# EAGLE design H_BRIDGE_rev2 (EAGLE 5.06)
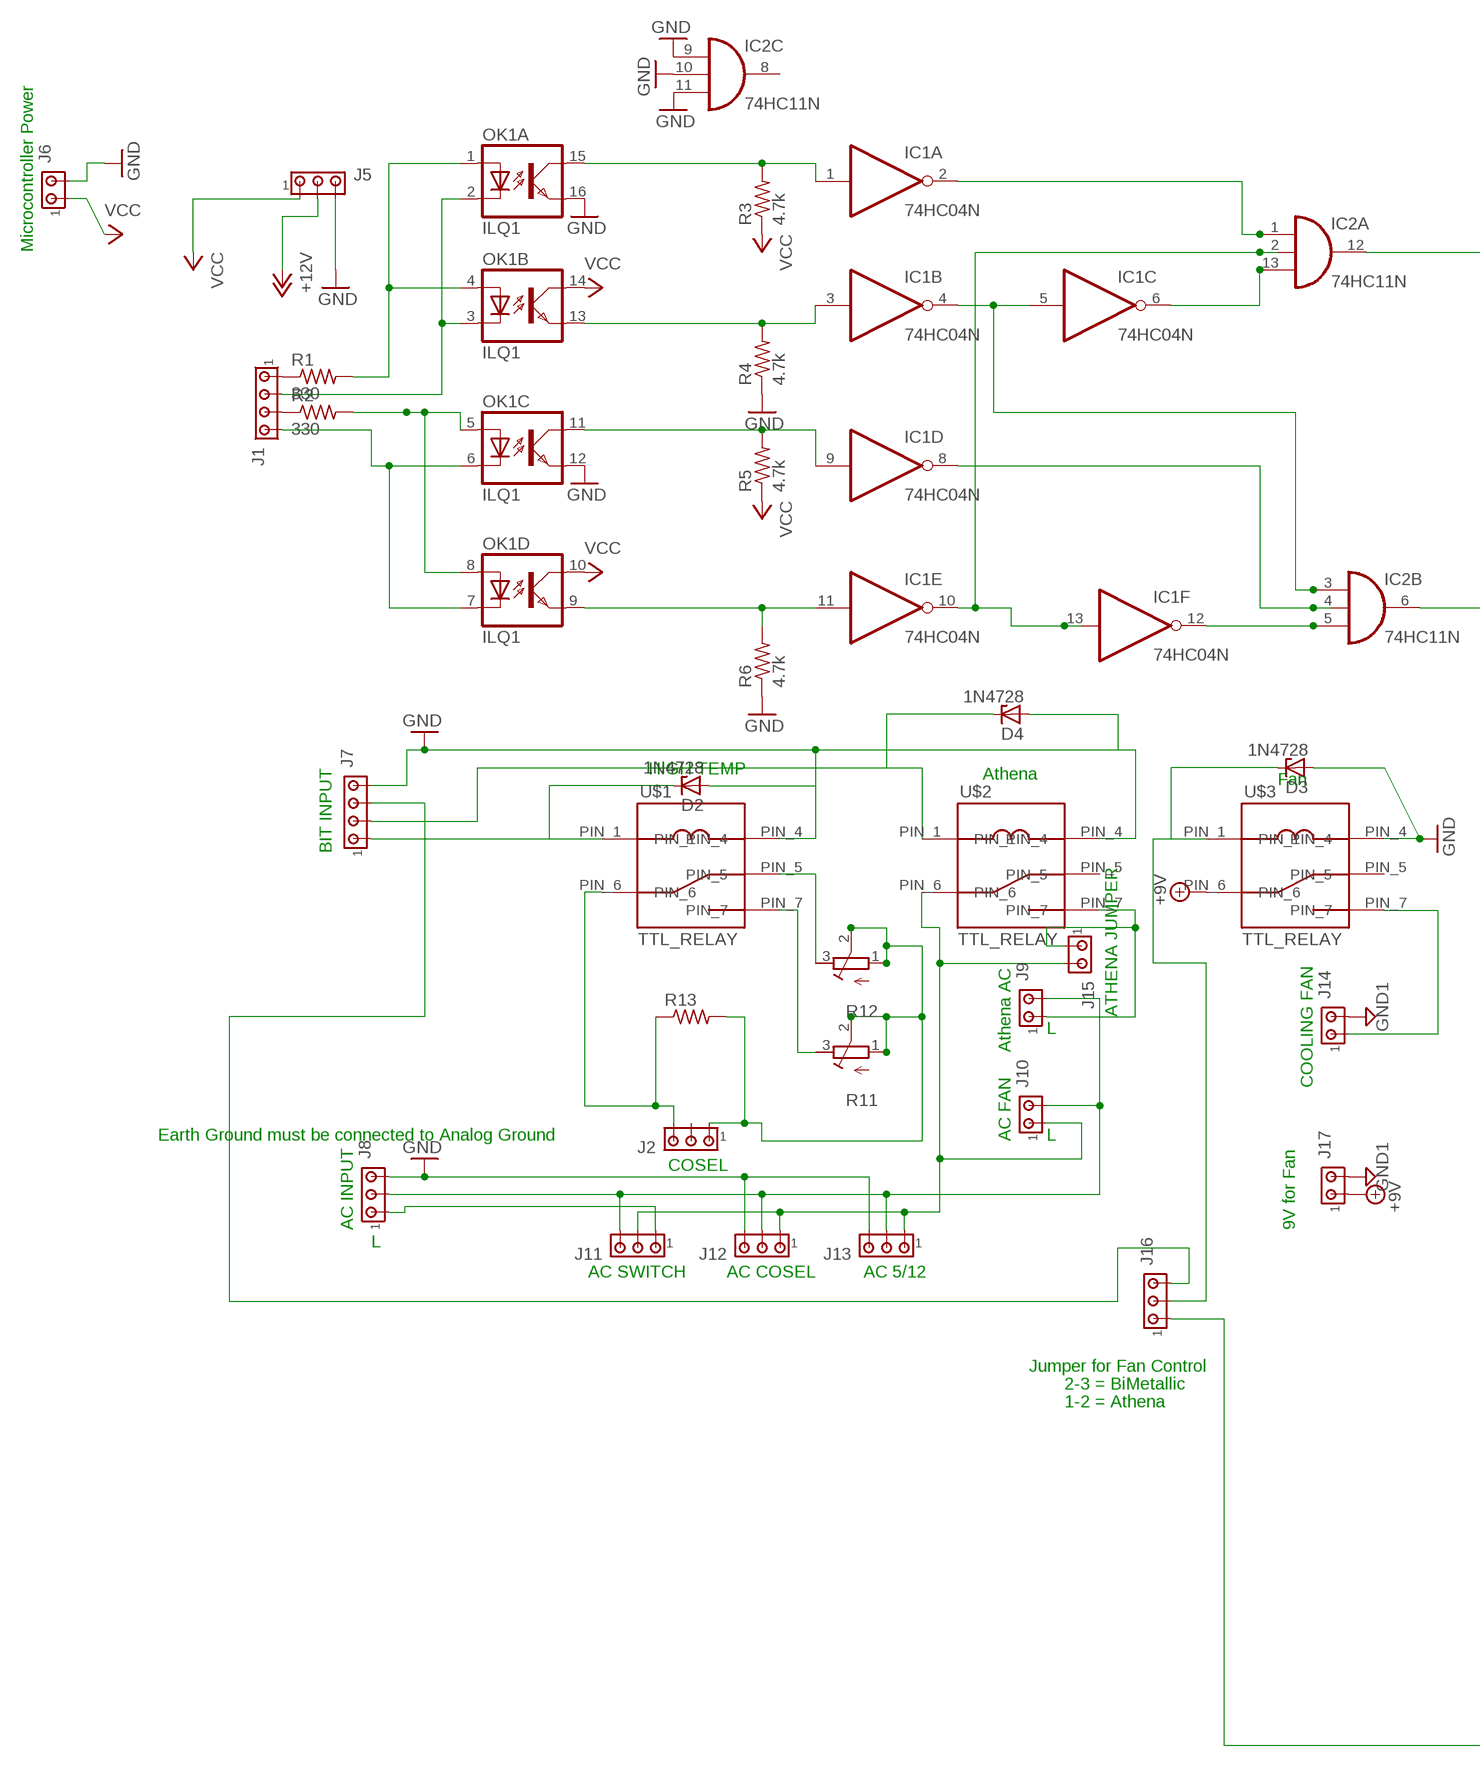
[diagram p0: schematic, sheet 1, part 1 of 2]
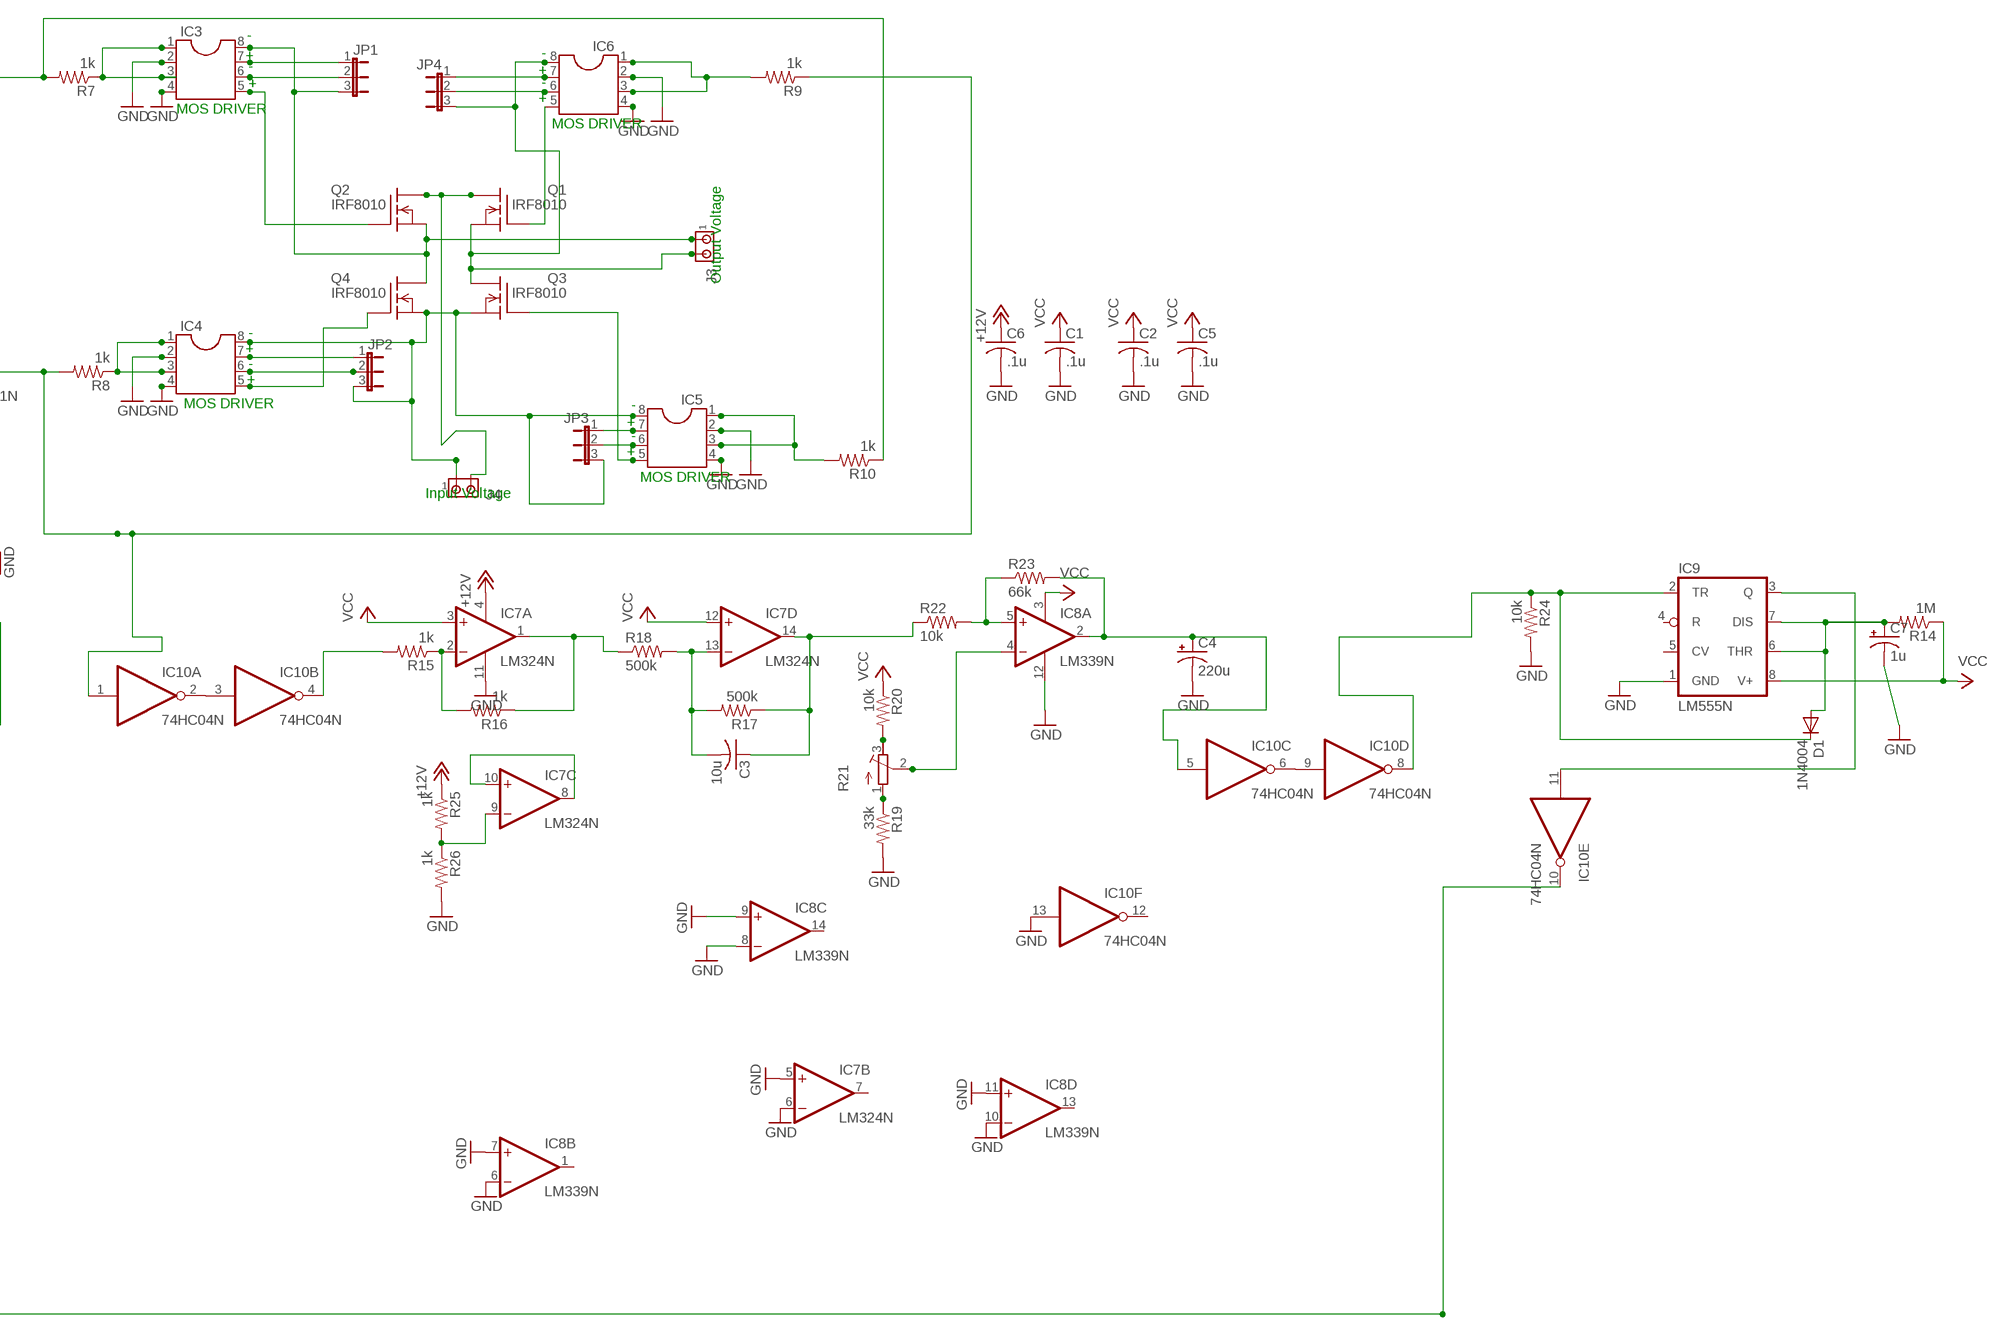
[diagram p1: schematic, sheet 1, part 2 of 2]

## Parts
C1  .1u  C-US025-030X050  [C025-030X050]
C2  .1u  C-US025-030X050  [C025-030X050]
C3  10u  C-US050-025X075  [C050-025X075]
C4  220u  CPOL-USE5-13  [E5-13]
C5  .1u  C-US025-030X050  [C025-030X050]
C6  .1u  C-US025-030X050  [C025-030X050]
C7  1u  CPOL-USE2.5-6  [E2,5-6]
D1  1N4004  [DO41-10]
D2  1N4728  [DO41Z10]
D3  1N4728  [DO41Z10]
D4  1N4728  [DO41Z10]
IC1  74HC04N  [DIL14]
IC2  74HC11N  [DIL14]
IC3  DIL8  [DIL08]
IC4  DIL8  [DIL08]
IC5  DIL8  [DIL08]
IC6  DIL8  [DIL08]
IC7  LM324N  [DIL14]
IC8  LM339N  [DIL14]
IC9  LM555N  [DIL08]
IC10  74HC04N  [DIL14]
J1  MTA04-100  [10X04MTA]
J2  MTA03-100  [10X03MTA]
J3  MTA02-156  [1X2MTA]
J4  MTA02-156  [1X2MTA]
J5  MTA03-156  [1X3MTA]
J6  MTA02-100  [10X02MTA]
J7  MTA04-100  [10X04MTA]
J8  MTA03-156  [1X3MTA]
J9  MTA02-100  [10X02MTA]
J10  MTA02-156  [1X2MTA]
J11  MTA03-156  [1X3MTA]
J12  MTA03-156  [1X3MTA]
J13  MTA03-156  [1X3MTA]
J14  MTA02-156  [1X2MTA]
J15  MTA02-100  [10X02MTA]
J16  MTA03-100  [10X03MTA]
J17  MTA02-156  [1X2MTA]
JP1  JP2E  [JP2]
JP2  JP2E  [JP2]
JP3  JP2E  [JP2]
JP4  JP2E  [JP2]
OK1  ILQ1  [DIL16]
Q1  IRF8010  IRF840  [TO220]
Q2  IRF8010  IRF840  [TO220]
Q3  IRF8010  IRF840  [TO220]
Q4  IRF8010  IRF840  [TO220]
R1  330  R-US_0204/7  [0204/7]
R2  330  R-US_0204/7  [0204/7]
R3  4.7k  R-US_0204/7  [0204/7]
R4  4.7k  R-US_0204/7  [0204/7]
R5  4.7k  R-US_0204/7  [0204/7]
R6  4.7k  R-US_0204/7  [0204/7]
R7  1k  R-US_0204/7  [0204/7]
R8  1k  R-US_0204/7  [0204/7]
R9  1k  R-US_0204/7  [0204/7]
R10  1k  R-US_0204/7  [0204/7]
R11  R-TRIMM3296W  [RTRIM3296W]
R12  R-TRIMM3296W  [RTRIM3296W]
R13  R-US_0204/7  [0204/7]
R14  1M  R-US_0204/7  [0204/7]
R15  1k  R-US_0204/7  [0204/7]
R16  1k  R-US_0204/7  [0204/7]
R17  500k  R-US_0204/7  [0204/7]
R18  500k  R-US_0204/7  [0204/7]
R19  33k  R-US_0204/7  [0204/7]
R20  10k  R-US_0204/7  [0204/7]
R21  R-TRIMM3296W  [RTRIM3296W]
R22  10k  R-US_0204/7  [0204/7]
R23  66k  R-US_0204/7  [0204/7]
R24  10k  R-US_0204/7  [0204/7]
R25  1k  R-US_0204/7  [0204/7]
R26  1k  R-US_0204/7  [0204/7]
U$1  TTL_RELAY  [R1OS-E1Y1-J1.0K]
U$2  TTL_RELAY  [R1OS-E1Y1-J1.0K]
U$3  TTL_RELAY  [R1OS-E1Y1-J1.0K]

## Nets
+9V: J17.1 U$3.PIN_6
+12V: C6.1 IC7.4(P:V+) J5.2 R25.1
GND: C1.2 C2.2 C4.- C5.2 C6.2 C7.- D2.A D3.A D4.A IC2.9(C:I0) IC2.10(C:I1) IC2.11(C:I2) IC3.2 IC3.4 IC4.2 IC4.4 IC5.2 IC5.4 IC6.2 IC6.4 IC7.5(B:+IN) IC7.6(B:-IN) IC7.11(P:V-) IC8.6(B:-IN) IC8.7(B:+IN) IC8.8(C:-IN) IC8.9(C:+IN) IC8.10(D:-IN) IC8.11(D:+IN) IC8.12(P:GND) IC9.1(GND) IC10.13(F:I) J5.3 J6.2 J7.4 J8.3 J12.3 J13.3 OK1.12(C:EMIT) OK1.16(A:EMIT) R4.1 R6.1 R19.2 R24.2 R26.2 U$1.PIN_4 U$2.PIN_4 U$3.PIN_4
GND1: J14.2 J17.2
N$1: J1.1 R1.1
N$2: J1.3 R2.1
N$3: OK1.1(A:A) OK1.4(B:A) R1.2
N$4: J1.2 OK1.2(A:C) OK1.3(B:C)
N$5: OK1.5(C:A) OK1.8(D:A) R2.2
N$6: J1.4 OK1.6(C:C) OK1.7(D:C)
N$7: IC1.1(A:I) OK1.15(A:COL) R3.2
N$8: IC1.3(B:I) OK1.13(B:EMIT) R4.2
N$9: IC1.9(D:I) OK1.11(C:COL) R5.2
N$10: IC1.11(E:I) OK1.9(D:EMIT) R6.2
N$11: IC1.4(B:O) IC1.5(C:I) IC2.3(B:I0)
N$12: IC1.10(E:O) IC1.13(F:I) IC2.2(A:I1)
N$13: IC1.2(A:O) IC2.1(A:I0)
N$14: IC1.6(C:O) IC2.13(A:I2)
N$15: IC1.8(D:O) IC2.4(B:I1)
N$16: IC1.12(F:O) IC2.5(B:I2)
N$17: IC2.12(A:O) R7.2 R10.1
N$18: IC2.6(B:O) IC10.1(A:I) R8.2 R9.1
N$19: IC3.1 IC3.3 R7.1
N$20: IC5.1 IC5.3 R10.2
N$21: IC6.1 IC6.3 R9.2
N$22: IC4.1 IC4.3 R8.1
N$23: IC4.5 Q4.1(G)
N$24: IC5.5 Q3.1(G)
N$25: D3.C J16.2 U$3.PIN_1
N$26: IC3.5 Q2.1(G)
N$27: IC4.6 JP2.2
N$28: IC4.7 JP2.1
N$29: IC3.6 JP1.2
N$30: IC3.7 JP1.1
N$31: IC6.6 JP4.2
N$32: IC6.7 JP4.1
N$33: IC5.6 JP3.2
N$34: IC5.7 JP3.1
N$35: IC4.8 IC5.8 J4.1 JP2.3 JP3.3 Q3.3(S) Q4.3(S)
N$36: IC6.8 J3.2 JP4.3 Q1.3(S) Q3.2(D)
N$37: J7.3 J16.3
N$39: J4.2 Q1.2(D) Q2.2(D)
N$40: IC3.8 J3.1 JP1.3 Q2.3(S) Q4.2(D)
N$42: IC6.5 Q1.1(G)
N$43: D2.C J7.1 U$1.PIN_1
N$49: D4.C J7.2 U$2.PIN_1
N$50: R12.3(A) U$1.PIN_5
N$51: J2.1 R11.1(E) R11.2(S) R12.1(E) R12.2(S) R13.2
N$52: J8.1 J11.1
N$53: R11.3(A) U$1.PIN_7
N$54: J2.3 R13.1 U$1.PIN_6
N$55: J10.1 J11.2 J12.1 J13.1 J15.2 U$2.PIN_6
N$56: J9.1 J15.1 U$2.PIN_7
N$57: J8.2 J9.2 J10.2 J11.3 J12.2 J13.2
N$59: IC10.4(B:O) R15.2
N$60: IC7.2(A:-IN) R15.1 R16.2
N$61: IC7.8(C:OUT) IC7.10(C:+IN)
N$62: IC7.1(A:OUT) R16.1 R18.1
N$63: C3.2 IC7.13(D:-IN) R17.2 R18.2
N$64: C3.1 IC7.14(D:OUT) R17.1 R22.1
N$65: IC7.9(C:-IN) R25.2 R26.1
N$66: R20.2 R21.3(A)
N$67: R19.1 R21.1(E)
N$68: IC8.4(A:-IN) R21.2(S)
N$69: IC10.2(A:O) IC10.3(B:I)
N$70: IC8.5(A:+IN) R22.2 R23.1
N$71: C4.+ IC8.2(A:OUT) IC10.5(C:I) R23.2
N$72: IC10.10(E:O) J16.1
N$73: J14.1 U$3.PIN_7
N$74: IC10.6(C:O) IC10.9(D:I)
N$76: IC9.3(Q) IC10.11(E:I)
N$77: D1.C IC9.2(TR) IC10.8(D:O) R24.1
N$78: C7.+ D1.A IC9.6(THR) IC9.7(DIS) R14.2
VCC: C1.1 C2.1 C5.1 IC7.3(A:+IN) IC7.12(D:+IN) IC8.3(P:V+) IC9.8(V+) J5.1 J6.1 OK1.10(D:COL) OK1.14(B:COL) R3.1 R5.1 R14.1 R20.1
Unconnected: IC2.8(C:O) IC7.7(B:OUT) IC8.1(B:OUT) IC8.13(D:OUT) IC8.14(C:OUT) IC9.4(R) IC9.5(CV) IC10.12(F:O) J2.2 U$2.PIN_5 U$3.PIN_5

## Notes on the sheet
- -
- + | -
- -
- Microcontroller Power | +
- + | -
- +
- MOS DRIVER
- MOS DRIVER
- Output Voltage
- -
- +
- -
- +
- MOS DRIVER | -
- +
- -
- +
- MOS DRIVER
- Input Voltage
- HIGH TEMP
- Athena
- Fan
- BIT INPUT
- ATHENA JUMPER
- L
- Athena AC
- COOLING FAN
- Earth Ground must be connected to Analog Ground | AC FAN | L
- COSEL
- AC INPUT | 9V for Fan
- L
- AC SWITCH | AC COSEL | AC 5/12
- Jumper for Fan Control
- 2-3 = BiMetallic
- 1-2 = Athena

## Power pins joined to a net without a drawn wire
GND: IC1.7(P:GND) IC2.7(P:GND) IC10.7(P:GND)
VCC: IC1.14(P:VCC) IC2.14(P:VCC) IC10.14(P:VCC)

## Library data of the parts
C1-C3 C5 C6 = rcl:C-US: CAPACITOR, American symbol
C4 = rcl:CPOL-US: POLARIZED CAPACITOR, American symbol
C7 = resistor:CPOL-US: POLARIZED CAPACITOR, American symbol
D1 = diode:1N4004: DIODE general purpose rectifier, 1 A
D2-D4 = diode:1N4728: Z DIODE 3.3 V, 1W, 5 percent
IC1 IC10 = 74xx-eu:74*04: Hex INVERTER
IC2 = 74xx-eu:74*11: Triple 3-input AND gate
IC3-IC6 = ic-package:DIL8: Dual In Line / Socket
IC7 = linear:LM324: OP AMP
IC8 = linear:LM339: Low Power Low Offset Voltage Quad Comparators with open collector; LM139/LM239/LM339/LM2901/LM3302
IC9 = linear:*555: TIMER
J1 J7 = con-amp:MTA04-100: AMP connector
J2 J16 = con-amp:MTA03-100: AMP connector
J3 J4 J10 J14 J17 = con-amp:MTA02-156: AMP connector
J5 J8 J11-J13 = con-amp:MTA03-156: AMP connector
J6 J9 J15 = con-amp:MTA02-100: AMP connector
JP1-JP4 = jumper:JP2E: JUMPER
OK1 = optocoupler:ILQ1: SIEMENS OPTO COUPLER
Q1-Q4 = transistor-fet:IRF840: N-Channel Enhancement MOSFET (HEXFET); 500V; 8A; 0,85Ohm
R1-R10 R13-R20 R22-R26 = rcl:R-US_: RESISTOR, American symbol
R11 R12 R21 = rcl:R-TRIMM: Trimm resistor
U$1-U$3 = Anthony-Relay:TTL_RELAY

## Board
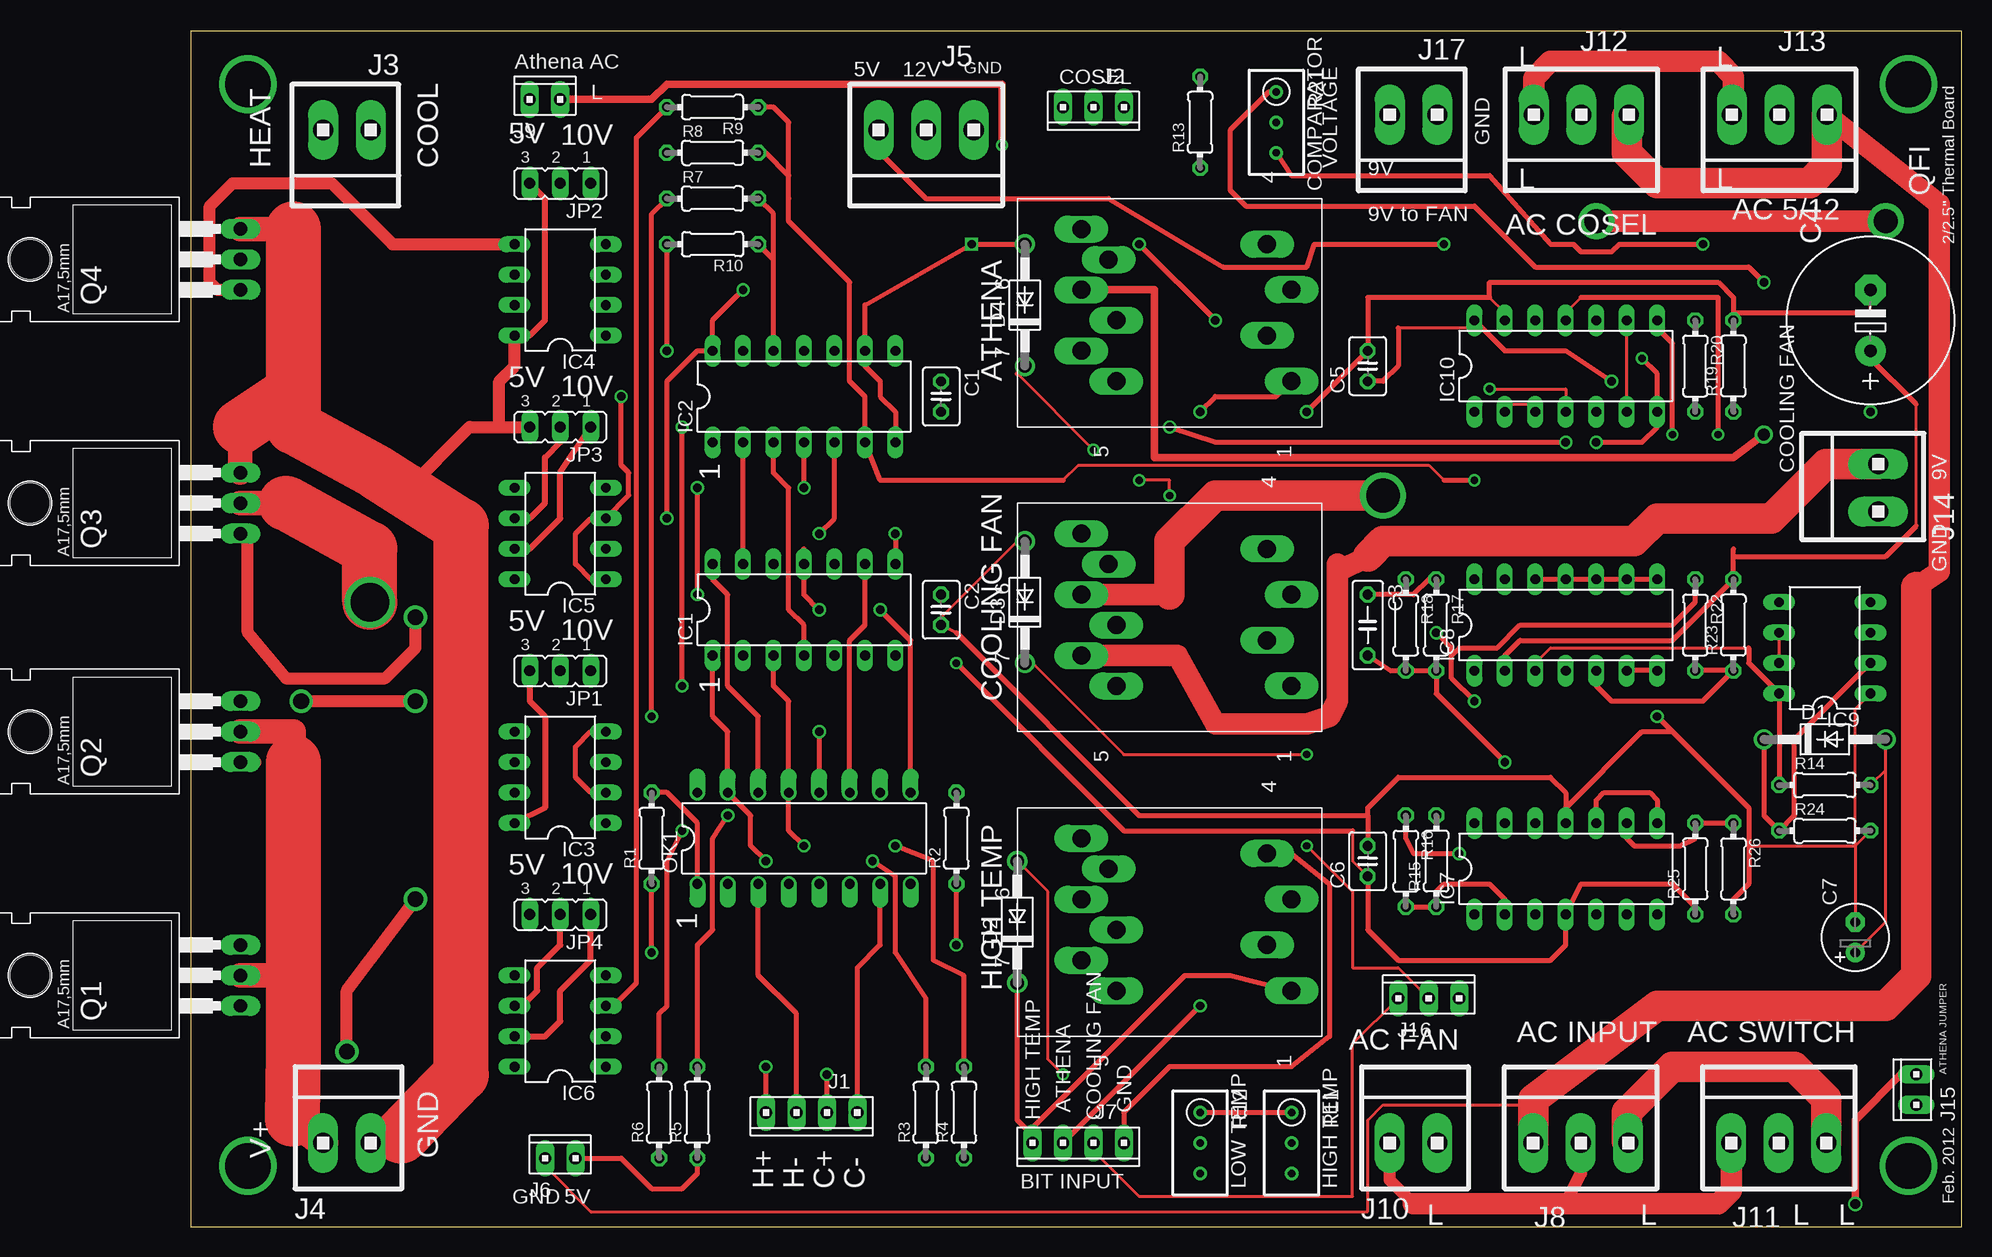
[diagram p2: board, top side]
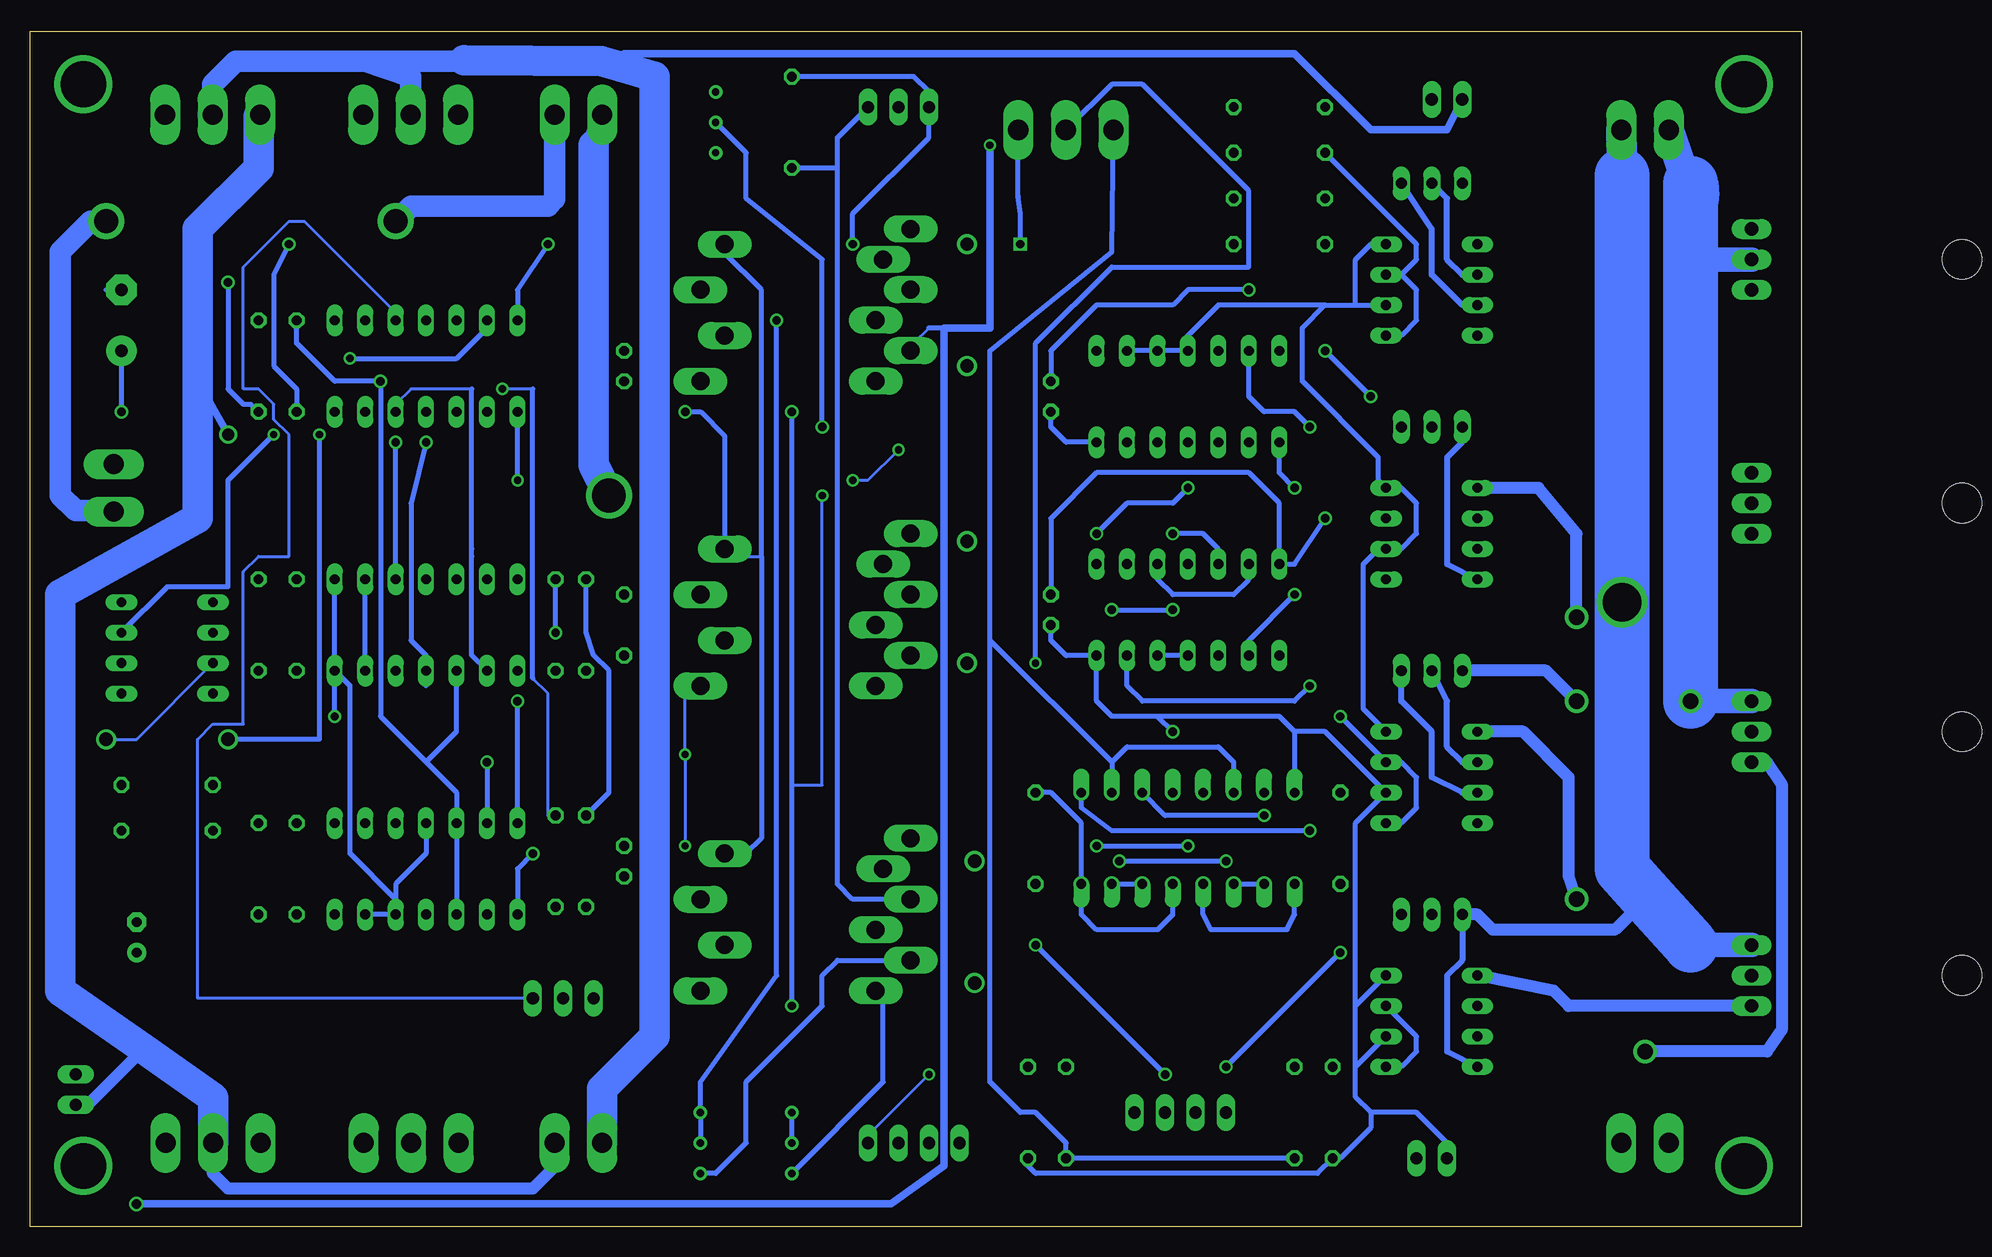
[diagram p3: board, bottom side, seen from below]

Size 147.62 x 99.67 mm. Coordinates in mm from the lower left corner, seen from the top.
Outline: 147.62,0 147.62,99.67 0,99.67 0,0 147.62,0
Copper layers (1*16): Top 0.035mm / dielectric 1.5mm / Bottom 0.035mm
Design rules "default": minimum track width 10mil, minimum drill 24mil, track to track 8mil, track to pad 8mil, pad to pad 8mil, via to via 8mil, smd to smd 8mil, copper to edge 40mil, drill to drill 8mil, minimum pad ring 10mil, minimum via ring 8mil, stop-mask expansion 4mil, vias tented up to drill 0mil, thermal gap 10mil

### Footprints (pad centres in the part's own frame; a part is rotated, then mirrored left to right if it is on the bottom)
C025-030X050 = drill 0.813 octagon: 1 -1.27,0; 2 1.27,0
C050-025X075 = drill 0.813 octagon: 1 -2.54,0; 2 2.54,0
E5-13 = drill 1.016 pad 2.54 round: + -2.54,0 | drill 1.016 pad 2.54 octagon: - 2.54,0
E2,5-6 = drill 0.813 pad 1.6 round: + -1.27,0 | drill 0.813 pad 1.6 octagon: - 1.27,0
DO41-10 = drill 1.118 round: A 5.08,0; C -5.08,0
DO41Z10 = drill 1.118 round: A 5.08,0; C -5.08,0
DIL14 = drill 0.813 long: 1 -7.62,-3.81; 2 -5.08,-3.81; 3 -2.54,-3.81; 4 0,-3.81; 5 2.54,-3.81; 6 5.08,-3.81; 7 7.62,-3.81; 8 7.62,3.81; 9 5.08,3.81; 10 2.54,3.81; 11 0,3.81; 12 -2.54,3.81; 13 -5.08,3.81; 14 -7.62,3.81
DIL08 = drill 0.813 long: 1 -3.81,-3.81; 2 -1.27,-3.81; 3 1.27,-3.81; 4 3.81,-3.81; 5 3.81,3.81; 6 1.27,3.81; 7 -1.27,3.81; 8 -3.81,3.81
10X04MTA = drill 1.016 long: 1 3.81,0; 2 1.27,0; 3 -1.27,0; 4 -3.81,0
10X03MTA = drill 1.016 long: 1 2.54,0; 2 0,0; 3 -2.54,0
1X2MTA = drill 1.676 long: 1 1.981,0; 2 -1.981,0
1X3MTA = drill 1.676 long: 1 3.937,0; 2 -0.025,0; 3 -3.988,0
10X02MTA = drill 1.016 long: 1 1.27,0; 2 -1.27,0
JP2 = drill 0.914 long: 1 -2.54,0; 2 0,0; 3 2.54,0
DIL16 = drill 0.813 offset: 1 -8.89,-3.81; 2 -6.35,-3.81; 3 -3.81,-3.81; 4 -1.27,-3.81; 5 1.27,-3.81; 6 3.81,-3.81; 7 6.35,-3.81; 8 8.89,-3.81; 9 8.89,3.81; 10 6.35,3.81; 11 3.81,3.81; 12 1.27,3.81; 13 -1.27,3.81; 14 -3.81,3.81; 15 -6.35,3.81; 16 -8.89,3.81
TO220 = drill 1.118 long: 1 -2.54,-6.35; 2 0,-6.35; 3 2.54,-6.35 | hole 3.302: 0,11.176
0204/7 = drill 0.813 octagon: 1 -3.81,0; 2 3.81,0
RTRIM3296W = drill 0.61 round: 1 0,-2.54; 2 0,0; 3 0,2.54
R1OS-E1Y1-J1.0K = drill 1.5 long: 89 8.89,17.145; P$2 7.62,4.572; P$3 11.43,2.54; P$9 13.97,17.78; P$10 16.51,20.066; PIN_1 3.81,2.54; PIN_4 15.24,4.572; PIN_5 3.81,17.145; PIN_6 11.43,20.066; PIN_7 6.35,20.066

### Placement (x,y rotation side)
C1  62.53,69.22 270 top
C2  62.53,51.44 270 top
C3  98.1,50.16 270 top
C4  140,75.56 90 top
C5  98.1,71.75 90 top
C6  98.1,30.48 90 top
C7  138.74,24.13 90 top
D1  136.19,40.64 0 top
D2  68.89,25.4 90 top
D3  69.52,52.07 90 top
D4  69.52,76.83 90 top
IC1  51.1,51.44 0 top
IC2  51.1,69.22 0 top
IC3  30.79,37.47 90 top
IC4  30.79,78.11 90 top
IC5  30.79,57.78 90 top
IC6  30.79,17.14 90 top
IC7  114.61,29.84 0 top
IC8  114.61,50.16 0 top
IC9  136.19,48.26 90 top
IC10  114.61,71.75 0 top
J1  51.74,9.53 180 top
J2  75.24,93.34 180 top
J3  13,91.44 180 top
J4  13,6.99 0 top
J5  61.27,91.44 180 top
J6  30.79,5.71 0 top
J7  73.97,6.99 180 top
J8  115.88,6.99 0 top
J9  29.52,93.98 0 top
J10  101.91,6.99 0 top
J11  132.39,6.99 0 top
J12  115.88,92.71 180 top
J13  132.39,92.71 180 top
J14  140.64,61.59 90 top
J15  143.81,11.43 90 top
J16  103.18,19.05 0 top
J17  101.91,92.71 180 top
JP1  30.79,46.35 180 top
JP2  30.79,87 180 top
JP3  30.79,66.67 180 top
JP4  30.79,26.04 180 top
OK1  51.1,32.38 0 top
Q1  -2.23,20.95 90 top
Q2  -2.23,41.27 90 top
Q3  -2.23,60.33 90 top
Q4  -2.23,80.64 90 top
R1  38.41,32.38 90 top
R2  63.8,32.38 90 top
R3  61.27,9.53 90 top
R4  64.44,9.53 90 top
R5  42.21,9.53 90 top
R6  39.04,9.53 90 top
R7  43.48,85.72 0 top
R8  43.48,89.53 0 top
R9  43.48,93.34 180 top
R10  43.48,81.92 180 top
R11  91.75,6.99 180 top
R12  84.12,6.99 180 top
R13  84.12,92.08 90 top
R14  136.19,36.83 0 top
R15  103.81,30.48 90 top
R16  101.27,30.48 270 top
R17  103.81,50.16 270 top
R18  101.27,50.16 270 top
R19  128.58,71.75 90 top
R20  125.4,71.75 270 top
R21  90.48,92.08 180 top
R22  125.4,50.16 270 top
R23  128.58,50.16 90 top
R24  136.19,33.02 0 top
R25  125.4,29.84 90 top
R26  128.58,29.84 270 top
U$1  94.29,15.88 90 top
U$2  94.29,66.67 90 top
U$3  94.29,41.27 90 top

### Tracks (layer width: path | path; a pad name or v marks a point on that pad's centre or on a via)
+9V  (via drill 2.8)
  Top 0.254: U$3.PIN_6 75.24,52.7
  Top 1.778: 75.24,52.7 81.59,52.7
  Top 2.54: 81.59,52.7 81.59,57.15 85.4,60.96 v99.37,60.96
  Bottom 1.778: 100.64,90.17 J17.1
  Bottom 2.54: v99.37,60.96 100.64,63.5 100.64,90.17
+12V  (via drill 0.61)
  Top 0.254: 96.83,33.02 96.83,30.48 C6.1
  Top 0.406: R25.1 125.4,26.67 123.5,28.57 115.88,28.57 IC7.4 114.61,23.5 113.34,22.23 100.64,22.23 98.1,24.77 C6.1 | v63.8,46.99 77.78,33.02 96.83,33.02
  Bottom 0.254: 61.27,91.44 J5.2
  Bottom 0.406: J5.2 61.29,90.83 61.27,90.81 61.27,91.44 | 61.27,91.44 61.27,92.08 | 61.27,91.44 57.45,95.25 54.91,95.25 46.02,86.36 46.02,80.01 57.45,80.01 63.8,73.66 v63.8,46.99
GND  (via drill 0.61, 0.7)
  Top 0.254: 138.74,31.75 R24.2 | 138.74,31.75 C7.- | IC9.1 138.74,43.18 138.74,31.75 | 63.8,49.53 C2.2 62.53,50.8 68.89,57.15 D3.A | 129.84,31.75 138.74,31.75 | 140,76.2 C4.- | 108.26,77.47 109.53,76.2 IC10.13 | 128.58,76.2 R19.2 | J6.2 29.52,5.08 33.33,1.27 98.1,1.27 98.1,8.89 99.37,10.16 111.89,10.16 | D2.A 71.43,27.94 71.43,13.97 v72.7,12.7
  Top 0.406: v52.38,41.27 OK1.12 | IC2.7 58.73,67.94 57.45,69.22 57.45,70.48 56.19,71.75 IC2.9 56.19,76.83 v65.08,81.92 D4.A | IC3.4 33.33,41.27 32.05,40.01 32.05,37.47 33.33,36.2 IC3.2 | R26.2 128.58,27.3 129.84,28.57 129.84,31.75 129.84,34.92 123.5,41.27 | IC8.7 IC8.6 | 123.5,41.27 v122.23,42.55 | 123.5,41.27 120.96,41.27 114.61,34.92 IC7.11 114.61,36.2 113.34,37.47 100.64,37.47 98.1,34.92 98.1,34.29 | 98.1,34.29 C6.2 | IC8.8 IC8.9 IC8.10 IC8.11 IC8.12 | v117.15,65.41 120.96,65.41 122.23,66.67 IC10.7 122.23,71.12 v120.96,72.39 | v93.02,67.94 C5.2 98.1,77.47 108.26,77.47 108.26,78.74 127.31,78.74 128.58,77.47 128.58,76.2 140,76.2 | 63.8,49.53 79.05,34.29 98.1,34.29 | J7.4 77.78,9.53 81.59,13.34 91.75,13.34 94.92,15.88 94.92,28.57 91.75,31.11 U$1.PIN_4
  Top 1.778: 143.81,53.34 145.72,54.61 145.72,85.27 J13.3
  Top 2.54: J8.3 111.89,10.16 111.89,10.62 122.23,18.41 141.28,18.41 143.81,20.95 143.81,53.34 | J13.3 136.37,88.44 134.93,87 122.23,87 119.69,89.53 119.69,92.53 J12.3
  Bottom 0.254: 109.53,74.93 IC10.13 | v72.7,12.7 77.78,7.62 J7.4 | 86.67,55.88 89.21,55.88 U$3.PIN_4
  Bottom 0.406: R4.1 64.44,5.08 63.8,4.45 40.31,4.45 R6.1 38.41,5.71 35.87,8.26 35.87,9.53 | 53.65,42.55 v52.38,41.27 | 53.65,42.55 57.45,42.55 58.73,43.81 IC1.7 61.27,47.62 62.53,48.9 C2.2 | IC2.9 IC2.10 IC2.11 51.1,74.3 48.56,76.83 39.67,76.83 | 42.21,41.27 OK1.16 | 42.21,41.27 43.48,42.55 53.65,42.55 | 35.87,9.53 37.13,10.79 37.13,13.34 | 37.13,13.34 IC6.2 | 37.13,18.41 IC6.4 | 37.13,13.34 37.13,18.41 | 42.21,41.27 39.67,41.27 IC3.2 37.13,33.66 37.13,18.41 | IC3.4 36.5,43.18 36.5,55.24 35.23,56.52 IC5.2 33.33,56.52 32.05,57.78 32.05,60.33 33.33,61.59 IC5.4 35.23,62.23 35.23,64.14 41.58,70.48 41.58,74.93 39.67,76.83 | 39.67,76.83 37.13,76.83 | 37.13,76.83 IC4.2 | IC4.4 35.87,81.92 37.13,80.64 37.13,76.83 | C1.2 62.53,66.67 61.27,65.41 IC2.7 | J5.3 65.25,85.9 65.08,84.45 v65.08,81.92 | v122.23,42.55 IC8.7 | IC7.5 IC7.6 IC7.5 | IC7.5 117.15,28.57 114.61,31.11 IC7.11 | IC7.5 117.15,27.3 120.96,31.11 120.96,45.09 IC8.7 | IC8.6 IC8.9 | IC8.7 IC8.8 | IC8.10 v117.15,65.41 | C4.- 141.28,78.11 | U$3.PIN_4 89.71,65.91 91.75,67.94 v93.02,67.94 | J6.2 29.52,6.99 32.05,9.53 35.87,9.53 | 109.53,74.93 112.07,72.39 v120.96,72.39 | U$2.PIN_4 89.71,81.15 86.67,78.11 86.67,55.88 86.67,32.38 87.94,31.11 U$1.PIN_4
GND1  (via drill 2)
  Top 1.778: v117.15,83.82 v141.28,83.82
  Bottom 1.778: J17.2 103.89,85.65 104.45,85.09 115.88,85.09 v117.15,83.82 | v141.28,83.82 142.55,83.82 145.09,81.28 145.09,60.96 143.81,59.69 140.72,59.69 J14.2
N$1  (via drill 0.7)
  Top 0.406: J1.1 v47.93,13.34 | v38.41,22.86 R1.1
  Bottom 0.406: v47.93,13.34 v38.41,22.86
N$2  (via drill 0.7)
  Top 0.406: J1.3 v53.01,12.7 | v63.8,23.5 R2.1
  Bottom 0.406: v53.01,12.7 v63.8,23.5
N$3
  Top 0.406: R1.2 39.67,36.2 42.21,33.66 OK1.1
  Bottom 0.406: OK1.1 42.21,26.04 42.85,24.77 49.2,24.77 49.84,26.04 OK1.4
N$4
  Top 0.406: J1.2 50.47,17.78 47.3,20.95 OK1.3
  Bottom 0.406: OK1.3 OK1.2
N$5
  Bottom 0.406: R2.2 62.53,36.2 59.99,33.66 OK1.8 59.99,26.04 58.73,24.77 53.65,24.77 52.38,26.04 OK1.5
N$6
  Top 0.406: J1.4 55.55,21.59 57.45,23.5 OK1.7
  Bottom 0.406: OK1.7 OK1.6
N$7  (via drill 0.7)
  Top 0.406: R3.2 61.27,19.05 58.73,22.86 58.73,29.21 v56.82,30.48 | v47.93,30.48 46.66,31.75 46.66,34.29 OK1.15 44.76,41.27 43.48,42.55 IC1.1
  Bottom 0.406: v56.82,30.48 v47.93,30.48
N$8  (via drill 0.7)
  Top 0.406: R4.2 64.44,20.95 61.9,22.23 61.9,30.48 v58.73,31.75 | v51.1,31.75 49.84,33.02 OK1.13 49.84,43.81 48.56,45.09 IC1.3
  Bottom 0.406: v58.73,31.75 v51.1,31.75
N$9  (via drill 0.7)
  Top 0.406: R5.2 42.21,23.5 43.48,24.77 43.48,32.38 v44.76,34.29 | 54.91,37.47 OK1.11 54.91,48.9 56.19,50.16 IC1.9
  Bottom 0.406: v44.76,34.29 53.01,34.29 OK1.11
N$10  (via drill 0.7)
  Top 0.406: R6.2 39.04,17.78 39.67,18.41 39.67,30.48 v40.95,33.02 | 59.99,37.47 OK1.9 59.99,48.9 v57.45,51.44 | v52.38,51.44 51.1,52.7 IC1.11 51.1,56.52
  Bottom 0.406: v40.95,33.02 57.45,33.02 59.99,34.92 OK1.9 | v57.45,51.44 v52.38,51.44
N$11
  Top 0.406: IC1.4 51.1,50.16 49.84,51.44 49.84,61.59 48.56,62.87 IC2.3
  Bottom 0.406: IC1.4 IC1.5
N$12
  Top 0.406: IC1.13 IC2.2
  Bottom 0.406: IC1.13 46.02,53.98 47.3,52.7 52.38,52.7 53.65,53.98 IC1.10
N$13  (via drill 0.7)
  Top 0.406: v42.21,52.7 v42.21,61.59
  Bottom 0.406: IC1.2 46.02,48.9 v42.21,52.7 | v42.21,61.59 43.48,62.87 IC2.1
N$14  (via drill 0.7)
  Top 0.406: v40.95,45.09 v40.95,66.67
  Bottom 0.406: IC1.6 56.19,45.09 54.91,43.81 42.21,43.81 v40.95,45.09 | v40.95,66.67 42.21,67.94 44.76,67.94 46.02,69.22 IC2.13
N$15  (via drill 0.7)
  Top 0.406: v58.73,57.78 IC1.8 | v51.1,61.59 IC2.4
  Bottom 0.406: v58.73,57.78 56.19,60.33 52.38,60.33 v51.1,61.59
N$16  (via drill 0.7)
  Top 0.406: v52.38,57.78 53.65,59.05 IC2.5
  Bottom 0.406: IC1.12 48.56,56.52 49.84,57.78 v52.38,57.78
N$17
  Top 0.406: IC2.12 48.56,80.64 | 48.56,80.64 48.56,84.45 R7.2 | 48.56,80.64 R10.1
N$18  (via drill 0.61)
  Top 0.254: 72.7,62.23 73.97,63.5 103.18,63.5 104.45,62.23
  Top 0.406: 49.84,85.72 49.84,83.82 54.91,78.74 54.91,70.48 56.19,69.22 IC2.6 57.45,62.23 72.7,62.23 | 49.84,85.72 49.84,87.63 47.93,89.53 R8.2 | R9.1 48.56,93.34 49.84,92.08 49.84,85.72 | 104.45,62.23 v106.99,62.23
  Bottom 0.406: v106.99,62.23 IC10.1
N$19  (via drill 0.7)
  Top 0.406: R7.1 38.41,84.45 v38.41,42.55
  Bottom 0.406: v38.41,42.55 IC3.3 33.33,38.73 32.05,37.47 32.05,34.92 33.33,33.66 IC3.1
N$20  (via drill 0.7)
  Top 0.406: v39.67,73.03 R10.2 | v35.87,69.22 35.87,63.5 36.5,62.87 36.5,60.96 IC5.3 33.33,59.05 32.05,57.78 32.05,55.24 33.33,53.98 IC5.1
  Bottom 0.406: v35.87,69.22 v39.67,73.03
N$21
  Top 0.406: IC6.3 35.23,18.41 37.13,20.32 37.13,90.81 R9.2
  Bottom 0.406: IC6.1 33.33,13.34 32.05,14.61 32.05,15.88 IC6.3
N$22
  Bottom 0.406: R8.1 32.05,81.92 32.05,80.64 33.33,79.38 | 33.33,79.38 IC4.3 | 33.33,79.38 32.05,78.11 32.05,75.56 33.33,74.3 IC4.1
N$23
  Top 1.016: IC4.5 16.82,81.92 11.73,87 3.48,87 1.57,85.09 1.57,78.74 2.21,78.11 Q4.1
N$24  (via drill 1.3 pad 1.27)
  Top 1.016: v18.72,50.8 18.72,48.26 16.18,45.72 7.92,45.72 4.75,49.53 4.75,57.15 Q3.1
  Bottom 1.016: IC5.5 21.89,61.59 18.72,57.78 v18.72,50.8
N$25  (via drill 0.61)
  Top 0.254: J16.2 100.64,21.59 96.83,21.59 96.83,27.94 v93.02,31.75 | 70.16,46.99 77.78,39.37 v93.02,39.37
  Top 0.406: D3.C 70.16,46.99
  Bottom 0.254: v93.02,31.75 v93.02,39.37 93.02,44.45 91.75,44.45 U$3.PIN_1
N$26  (via drill 1.3 pad 1.27)
  Top 1.016: v18.72,27.3 13,19.68 v13,14.61 | Q2.1 5.38,38.73
  Bottom 1.016: IC3.5 23.16,41.27 19.36,37.47 19.36,29.21 v18.72,27.3 | v13,14.61 2.85,14.61 1.57,16.51 1.57,36.83 2.85,38.73 Q2.1
N$27
  Bottom 0.508: IC4.6 28.25,79.38 29.52,80.64 29.52,85.72 JP2.2
N$28
  Bottom 0.508: IC4.7 28.25,76.83 30.79,79.38 30.79,83.19 JP2.1
N$29
  Bottom 0.508: IC3.6 28.25,38.73 29.52,40.01 29.52,43.81 JP1.2
N$30
  Bottom 0.508: IC3.7 28.25,36.2 30.79,37.47 30.79,41.27 33.33,43.81 JP1.1
N$31
  Top 0.508: IC6.6 27.61,18.41 28.88,19.68 28.88,21.59 30.79,23.5 JP4.2
N$32
  Top 0.508: IC6.7 29.52,15.88 30.79,17.14 30.79,19.68 33.33,22.23 JP4.1
N$33
  Top 0.508: IC5.6 28.25,59.05 29.52,60.33 29.52,64.14 30.79,65.41 JP3.2
N$34
  Top 0.508: IC5.7 28.25,56.52 30.79,59.05 30.79,62.87 JP3.1
N$35
  Top 0.508: IC4.8 28.25,74.3 29.52,75.56 29.52,85.72 JP2.3
  Top 1.016: 25.7,66.67 23.25,66.67 17.93,61.35 | 25.7,66.67 JP3.3 | IC4.8 26.98,71.75 25.7,70.48 25.7,66.67
  Top 2.032: 8.56,83.19 Q4.3 | 4.12,66.67 Q3.3
  Top 2.54: J4.1 17.53,7.54 | 8.56,69.22 7.92,69.22
  Top 4.572: 17.53,7.54 22.53,12.7 22.53,58.42 17.93,61.35 15.54,62.87 8.56,66.67 8.56,69.22 8.56,83.19 | 7.92,69.22 4.12,66.67
  Bottom 0.508: IC5.8 29.52,55.24 29.52,64.14 28.25,65.41 JP3.3
N$36  (via drill 3.2 pad 3.81)
  Top 2.032: 7.92,60.33 Q3.2
  Top 4.572: 7.92,60.33 14.91,56.52 v14.91,52.07
  Bottom 0.508: IC6.8 29.52,14.61 29.52,20.95 28.25,22.23 JP4.3
  Bottom 1.016: JP4.3 26.98,26.04 25.7,24.77 15.52,24.77 12.79,27.49
  Bottom 2.032: Q1.3 9.2,23.5
  Bottom 2.54: 14.91,87 J3.2
  Bottom 4.572: 14.91,87.63 14.91,87 v14.91,52.07 14.91,29.84 12.79,27.49 9.2,23.5
N$37
  Top 0.254: J16.3 96.83,15.24 96.83,2.54 79.05,2.54 75.24,6.35 J7.3
N$39
  Top 2.032: 8.56,38.73 8.56,41.27 Q2.2 | 8.56,20.95 Q1.2
  Top 2.54: J4.2 8.48,8.97
  Top 4.572: 8.48,8.97 8.56,14.61 8.56,20.95 8.56,38.73
N$40  (via drill 1.3 pad 1.27)
  Top 0.508: IC3.8 29.52,34.92 29.52,42.55 28.25,43.81 JP1.3
  Top 1.016: v9.2,43.81 v18.72,43.81
  Bottom 1.016: JP1.3 21.26,46.35 v18.72,43.81
  Bottom 2.032: Q2.3 v9.2,43.81 | 9.2,80.64 Q4.2
  Bottom 2.54: 9.12,85.8 J3.1
  Bottom 4.572: 9.12,85.8 9.2,87 9.2,80.64 v9.2,43.81
N$42
  Bottom 1.016: Q1.1 19.36,18.41 20.62,19.68 IC6.5
N$43
  Top 0.406: J7.1 70.16,7.62 | 70.16,7.62 70.16,8.26 82.86,20.95 86.67,20.95 U$1.PIN_1 | D2.C 68.89,8.89 70.16,7.62
N$44  (via drill 3.8)
  other vias: 4.75,5.08
N$45  (via drill 3.8)
  other vias: 4.75,95.25
N$46  (via drill 3.8)
  other vias: 143.18,5.08
N$48  (via drill 3.8)
  other vias: 143.18,95.25
N$49  (via drill 0.61, 0.7)
  Top 0.254: v75.24,64.77 68.89,71.12 | v79.05,62.23 81.59,62.23 v81.59,60.96
  Top 0.406: J7.2 v84.12,18.41 | v84.12,67.94 85.4,69.22 90.48,69.22 U$2.PIN_1 | 68.89,71.12 D4.C
  Bottom 0.254: v75.24,64.77 77.78,62.23 v79.05,62.23 | v81.59,60.96 81.59,36.83 84.12,36.83
  Bottom 0.406: v84.12,18.41 84.12,36.83 v84.12,67.94
N$50
  Bottom 0.406: R12.3 76.51,12.06 76.51,19.05 U$1.PIN_5
N$51  (via drill 0.7)
  Top 0.406: v85.4,75.56 v79.05,81.92 | R12.1 R11.1
  Bottom 0.406: R12.2 R12.1 | R11.1 91.75,12.06 85.4,20.95 v85.4,75.56 | R11.1 R11.2 R11.1 | v79.05,81.92 79.05,84.45 72.7,90.81 J2.1 72.7,94.61 73.97,95.89 R13.2
N$52
  Top 0.406: J8.1 119.69,7.11
  Top 2.54: J11.1 136.32,10.67 133.66,13.34 123.5,13.34 119.69,9.53 119.69,7.11
N$53
  Bottom 0.406: R11.3 90.48,4.45 87.94,6.99 87.94,12.06 81.59,18.41 81.59,20.95 80.32,22.23 U$1.PIN_7
N$54
  Bottom 0.406: U$1.PIN_6 79.05,27.3 80.32,28.57 80.32,88.27 | 80.32,88.27 80.32,90.81 J2.3 | 80.32,88.27 R13.1
N$55  (via drill 1)
  Top 0.61: 72.7,78.11 U$2.PIN_6 80.32,78.11 80.32,64.14 128.55,64.14 v131.09,66.04
  Top 1.778: J12.1 111.94,95.76 113.34,97.16 127.31,97.16 128.58,95.89 128.58,92.84 J13.1
  Bottom 0.61: 133.63,70.48 131.12,66.04 v131.09,66.04
  Bottom 1.016: J10.1 103.89,5 105.72,3.17 131.12,3.17 132.39,4.45 132.39,5.69 J11.2 | J15.2 142.8,10.16 138.14,14.82
  Bottom 2.54: J11.2 132.36,10.77 138.14,14.82 145.09,19.68 145.09,52.7 133.63,59.08 133.63,70.48 133.63,83.21 128.58,88.27 128.58,92.58 J13.1
N$56  (via drill 0.61, 0.8)
  Top 0.61: J9.1 38.41,93.98 39.67,95.25 67.62,95.25 v67.62,90.17 | v138.74,1.91 138.74,8.89 142.55,12.7 J15.1
  Bottom 0.254: 72.7,74.93 73.97,73.66 U$2.PIN_7
  Bottom 0.406: 71.43,74.93 72.7,74.93
  Bottom 0.61: v67.62,90.17 67.62,74.93 71.43,74.93 71.43,5.08 75.87,1.91 v138.74,1.91
N$57
  Top 1.016: J10.2 99.92,3.89 101.91,1.91 | 114.61,1.91 115.88,4.45 115.88,6.96 J8.2
  Top 1.778: J11.3 128.4,3 127.31,1.91 114.61,1.91 101.91,1.91
  Bottom 0.254: 98.41,96.7 98.1,97.79
  Bottom 0.406: 111.43,97.23 112.07,96.6 110.8,97.16
  Bottom 0.61: J9.2 29.52,91.44 35.87,91.44 42.21,97.79 98.1,97.79
  Bottom 1.778: 110.8,97.16 119.69,97.16 | 119.69,97.16 130.48,97.16 132.39,95.25 132.39,92.73 | J12.2 115.9,95.86 119.69,97.16
  Bottom 2.54: J10.2 99.92,11.51 95.56,15.88 95.56,95.89 98.41,96.7 100,97.16 111.43,97.23 | 132.39,92.73 J13.2
N$59  (via drill 0.61)
  Top 0.254: v108.26,69.85 114.61,69.85 IC10.4
  Bottom 0.254: 105.72,45.72 104.45,44.45 104.45,34.29 R15.2 | 105.72,69.85 v108.26,69.85
  Bottom 0.406: 105.72,45.72 105.72,69.85
N$60
  Top 0.406: IC7.2 109.53,27.3 108.26,28.57 104.45,28.57 103.81,27.94 R15.1 R16.2
N$61
  Top 0.406: IC7.8 122.23,35.56 121.59,36.2 117.78,36.2 117.15,35.56 IC7.10 117.15,33.02
N$62  (via drill 0.7)
  Top 0.406: v105.72,31.11 101.91,31.11 101.27,32.38 R16.1
  Bottom 0.406: IC7.1 106.99,29.84 v105.72,31.11 | R16.1 99.37,36.2 99.37,46.35 100.64,47.62 101.27,49.53 R18.1
N$63  (via drill 0.7)
  Top 0.406: v109.53,38.73 103.81,44.45 R17.2 R18.2 100,46.35 C3.2
  Bottom 0.406: v109.53,38.73 IC7.13
N$64  (via drill 0.7)
  Top 0.406: v103.81,49.53 105.08,48.26 105.08,47.62 | 105.08,47.62 105.08,45.72 v106.99,43.81 | R17.1 103.18,53.98 101.91,52.7 C3.1 | R22.1 125.4,52.07 123.5,50.16 110.8,50.16 108.89,48.26 105.72,48.26 105.08,47.62
  Bottom 0.406: v103.81,49.53 R17.1 | IC7.14 v106.99,43.81
N$65
  Top 0.406: R26.1 R25.2 125.4,32.38 124.13,31.75 120.32,31.75 119.69,32.38 IC7.9
N$66  (via drill 0.7)
  Top 0.406: v126.04,81.92 119.05,81.92 118.42,81.28 115.88,81.28 115.24,81.92 113.34,81.92 108.26,87.63 91.75,87.63 R21.3
  Bottom 0.406: R20.2 125.4,69.85 127.31,71.75 127.31,79.38 v126.04,81.92
N$67  (via drill 0.7)
  Top 0.406: R21.1 89.84,94.61 86.67,91.44 86.67,86.36 87.94,85.09 106.99,85.09 112.07,80.01 129.84,80.01 v131.12,78.74
  Bottom 0.406: v131.12,78.74 131.12,69.85 129.84,68.58 129.21,68.58 R19.1
N$68  (via drill 0.7)
  Top 0.406: v81.59,66.67 85.4,65.41 v114.61,65.41
  Bottom 0.406: R21.2 87.94,89.53 87.94,85.72 81.59,80.64 v81.59,66.67 | v114.61,65.41 115.88,60.33 115.88,48.9 114.61,47.62 IC8.4 114.61,45.09
N$69
  Top 0.254: IC10.2 109.53,68.58 112.07,68.58 IC10.3
N$70
  Top 0.406: IC8.5 117.15,45.09 118.42,43.81 126.04,43.81 R23.1 R22.2
N$71  (via drill 0.7)
  Top 0.254: 143.81,58.42 143.81,68.58 | 140,72.39 C4.+
  Top 0.406: IC8.2 109.53,47.62 110.8,48.9 123.5,48.9 R23.2 128.58,55.88 | 128.58,55.88 128.58,56.52 | 143.81,68.58 140,72.39 | 143.81,58.42 141.28,55.88 128.58,55.88
  Bottom 0.254: 110.8,69.85 115.88,69.85 117.15,68.58 IC10.5
  Bottom 0.406: C4.+ v140,67.94 | 110.8,55.88 110.8,47.62 IC8.2 | 110.8,55.88 110.8,56.52 | 110.8,55.88 110.8,69.85
N$72
  Bottom 0.254: J16.1 133.66,19.05 133.66,40.64 132.39,41.91 129.84,41.91 129.84,54.61 128.58,55.88 126.04,55.88 126.04,66.04 127.31,67.31 127.31,68.58 128.58,69.85 129.84,69.85 129.84,80.01 126.04,83.82 124.77,83.82 117.15,76.2 IC10.10
N$73
  Top 0.406: 95.56,55.24 95.56,54.61 | U$3.PIN_7 73.97,47.62
  Top 1.778: 95.56,54.61 98.1,55.88 | 95.56,55.24 95.56,43.81 94.92,42.55 93.02,41.91 85.4,41.91 82.22,47.62 U$3.PIN_7
  Top 2.54: 98.1,55.88 99.37,57.15 120.32,57.15 122.23,59.05 131.75,59.05 136.27,63.58 J14.1
N$74
  Top 0.254: IC10.6 IC10.9
N$76  (via drill 0.61)
  Top 0.254: 115.88,77.47 114.61,76.2 IC10.11
  Top 0.406: 115.88,77.47 127.31,77.47 v127.31,66.04
  Bottom 0.406: v127.31,66.04 131.12,62.23 131.12,53.34 136.19,53.34 IC9.3
N$77  (via drill 0.61)
  Top 0.254: 122.23,74.93 IC10.8
  Top 0.406: D1.C 131.12,34.29 R24.1 133.66,34.29 133.66,40.64 IC9.2 | 122.23,74.93 123.5,73.66 v123.5,66.04
  Bottom 0.406: v123.5,66.04 123.5,40.64 D1.C
N$78
  Top 0.254: IC9.7 IC9.6 | 141.28,38.1 R14.2 | 141.28,38.1 D1.A | C7.+ 141.28,25.4 141.28,38.1
  Bottom 0.254: IC9.7 138.74,40.64 D1.A
VCC  (via drill 0.7)
  Top 0.254: 100.64,74.93 106.99,74.93 IC10.14 | 129.84,48.26 113.34,48.26 112.07,46.99 IC8.3
  Top 0.406: OK1.14 47.3,42.55 44.76,45.09 44.76,52.7 43.48,53.98 IC1.14 | v39.67,59.05 39.67,70.48 42.21,73.03 IC2.14 43.48,75.56 v46.02,78.11 | v104.45,81.92 93.65,81.92 93.02,80.01 86.03,80.01 76.51,85.72 61.27,85.72 57.45,89.53 57.45,91.31 J5.1 | v118.42,70.48 114.61,73.03 109.53,73.03 IC10.14 | C5.1 99.37,70.48 100.64,71.75 100.64,74.93 | J6.1 35.87,5.71 38.41,3.17 40.95,3.17 42.21,4.45 R5.1 | R14.1 IC9.8 129.84,46.99 129.84,48.26
  Bottom 0.406: R5.1 R3.1 61.27,6.99 63.8,9.53 65.08,9.53 67.62,12.06 67.62,48.9 | v39.67,59.05 42.21,55.24 IC1.14 43.48,60.33 46.02,62.87 58.73,62.87 62.53,59.05 C2.1 | 67.62,48.9 57.45,38.73 | 67.62,48.9 67.62,73.03 57.45,81.28 J5.1 | 57.45,38.73 OK1.10 | 57.45,38.73 56.19,40.01 48.56,40.01 47.3,38.73 OK1.14 | C1.1 62.53,73.03 58.73,76.83 52.38,76.83 51.1,78.11 v46.02,78.11 | v104.45,81.92 106.99,78.11 IC10.14 | IC7.3 IC7.12 112.07,36.2 114.61,38.73 | 114.61,38.73 118.42,42.55 v118.42,70.48 122.23,70.48 125.4,73.66 R20.1 | IC8.3 112.07,41.27 114.61,38.73

### Text on the board
tNames: L | L | Athena AC | 5V | 12V | GND | COSEL | L | 5V | 10V | GND | QFI | HEAT | COOL | VOLTAGE | 9V | L | L | COMPARATOR | AC 5/12 | 9V to FAN | AC COSEL | 2/2.5" Thermal Board | 5V | ATHENA | 10V | COOLING FAN | 1 | 9V | GND | 5V | 10V | 1 | COOLING FAN | 5V | 10V | 1 | HIGH TEMP | AC FAN | AC INPUT | AC SWITCH | ATHENA JUMPER | ATHENA | GND | HIGH TEMP | COOLING FAN | V+ | GND | BIT INPUT | GND | 5V | H+ | H- | C+ | C- | LOW TEMP | HIGH TEMP | L | L | L | L | Feb. 2012